# Altium schematic sheet CAN.SchDoc
size 420 x 297 mm; SheetNumber: 3; SheetTotal: 6
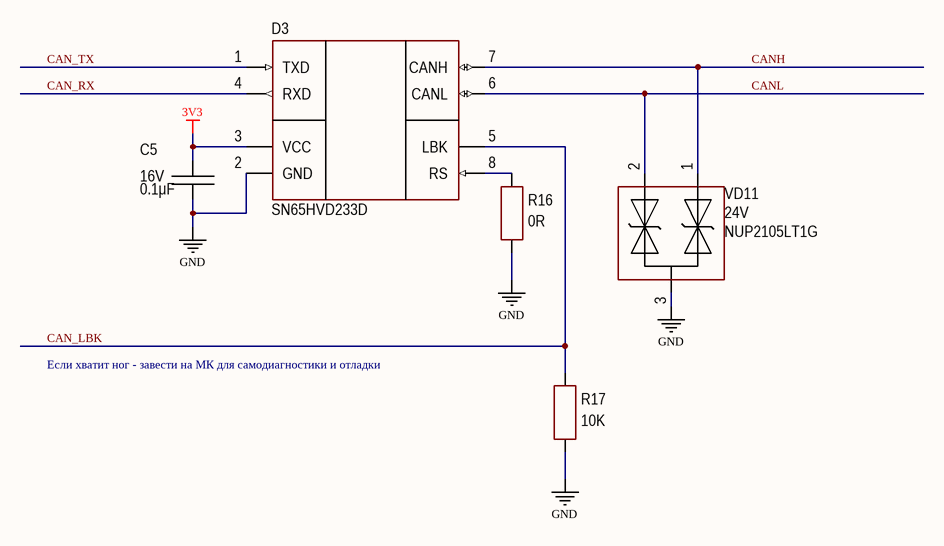
[diagram p0: CAN.SchDoc]

## Parts
C5  value 0.1μF  Voltage: 16V  [CAP: 0805]
D3  PartNumber: SN65HVD233D  [8-SOIC]
R16  value 0R  [RES: 1206]
R17  value 10K  [RES: 1206]
VD11  Voltage: 24V  PartNumber: NUP2105LT1G  [SOT23]

## Nets
3V3: C5.2 D3.3(VCC)
GND: C5.1 D3.2(GND) R16.1 R17.1 VD11.3
CAN_LBK: D3.5(LBK) R17.2
CAN_RX: D3.4(RXD)
CAN_TX: D3.1(TXD)
CANH: D3.7(CANH) VD11.1
CANL: D3.6(CANL) VD11.2
NetD3_8: D3.8(RS) R16.2

## Notes on the sheet
- Если хватит ног - завести на МК для самодиагностики и отладки
- Подп. и дата
- Инв. № дубл.
- Взам. инв. №
- Инв. № подл.
- Изм.
- Лист
- № докум.
- Подп.
- Дата
- 2.106-A3
- Копировал
- Формат А3

## Library data of the parts
C5 = Ceramic_0805: Manufacturer: Yageo; PartNumber: CC0805KRX7R7BB104; ValueManufacturerPartNumber: Ceramic capacitor, 0.1μF, X7R, ±10%, 16V, 0805, -55...+125°C; TypeCapacitor: Ceramic capacitor; Tolerance: ±10%; TypeDielectric: X7R; Package: 0805; HelpURL: https://www.digikey.com/product-detail/en/yageo/CC0805KRX7R7BB104/311-1142-1-ND/303052; Temperature: -55...+125°C
D3 = SN65HVD231DR: CAN; Manufacturer: Texas Instruments; ValueManufacturerPartNumber: IC CAN transceiver, 1Mbps, Half-duplex, 3...3.6V, -40...+85°C, 8-SOIC; Supply: 3...3.6V; DataRate: 1Mbps; TypeDuplex: Half-duplex; HelpURL: https://www.digikey.com/product-detail/en/texas-instruments/SN65HVD231DR/296-26343-1-ND/2254977; Package: 8-SOIC; ComponentType: IC CAN transceiver; Temperature: -40...+85°C
R16 = Resistor_1206: Manufacturer: Yageo; PartNumber: RC1206JR-07100RL; ValueManufacturerPartNumber: Resistor film, 0R, ±5%, 1206, 0.25W, -55...+125°C; TypeResistor: Resistor film; Power: 0.25W; Tolerance: ±5%; Package: 1206; HelpURL: https://www.digikey.com/product-detail/en/yageo/RC1206JR-07100RL/311-100ERCT-ND/732153; Temperature: -55...+125°C
R17 = Resistor_1206: Manufacturer: Yageo; PartNumber: RC1206JR-07100RL; ValueManufacturerPartNumber: Resistor film, 10K, ±5%, 1206, 0.25W, -55...+125°C; TypeResistor: Resistor film; Power: 0.25W; Tolerance: ±5%; Package: 1206; HelpURL: https://www.digikey.com/product-detail/en/yageo/RC1206JR-07100RL/311-100ERCT-ND/732153; Temperature: -55...+125°C
VD11 = TVS_array: Manufacturer: Diodes Incorporated; ValueManufacturerPartNumber: Zener diode, 24V, 500mW, 0.9V, 17Ohm, SOD-123, -55...+150°C; TypeDiode: Zener diode; Current: 500mW; VoltageDrop: 0.9V; RecoveryTime: 17Ohm; Package: SOD-123; HelpURL: https://www.digikey.com/product-detail/en/diodes-incorporated/MMSZ5231B-7-F/MMSZ5231B-FDICT-ND/755506; Temperature: -55...+150°C